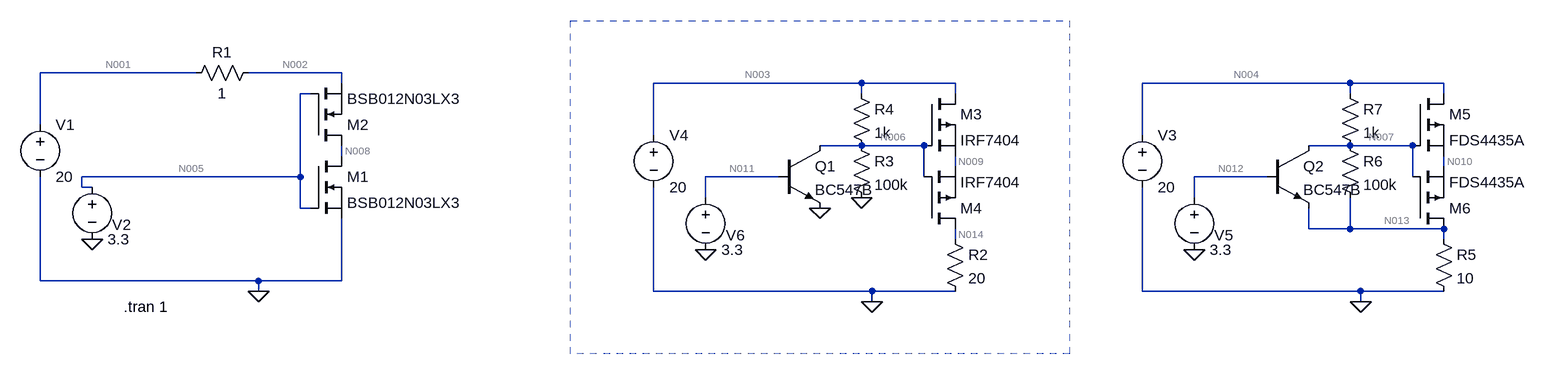
[diagram p0: schematic battery_switch.asc]
battery_switch.asc, the LTspice schematic file:
Version 4
SHEET 1 2052 680
WIRE 0 48 -240 48
WIRE 224 48 80 48
WIRE 224 64 224 48
WIRE 1024 64 704 64
WIRE 1168 64 1024 64
WIRE 1776 64 1456 64
WIRE 1920 64 1776 64
WIRE 176 80 160 80
WIRE 1024 80 1024 64
WIRE 1168 80 1168 64
WIRE 1776 80 1776 64
WIRE 1920 80 1920 64
WIRE -240 128 -240 48
WIRE 704 144 704 64
WIRE 1456 144 1456 64
WIRE 1024 160 960 160
WIRE 1120 160 1024 160
WIRE 1776 160 1712 160
WIRE 1872 160 1776 160
WIRE 224 176 224 160
WIRE 1168 192 1168 176
WIRE 1920 192 1920 176
WIRE 160 208 160 80
WIRE 160 208 -176 208
WIRE 896 208 784 208
WIRE 1120 208 1120 160
WIRE 1648 208 1536 208
WIRE 1872 208 1872 160
WIRE -176 224 -176 208
WIRE -160 224 -176 224
WIRE 784 240 784 208
WIRE 1536 240 1536 208
WIRE 160 256 160 208
WIRE 176 256 160 256
WIRE 1712 288 1712 256
WIRE 1776 288 1776 240
WIRE 1776 288 1712 288
WIRE 1920 288 1776 288
WIRE 1168 304 1168 288
WIRE 1920 304 1920 288
WIRE -240 368 -240 208
WIRE 96 368 -240 368
WIRE 224 368 224 272
WIRE 224 368 96 368
WIRE 96 384 96 368
WIRE 704 384 704 224
WIRE 1040 384 704 384
WIRE 1168 384 1040 384
WIRE 1456 384 1456 224
WIRE 1792 384 1456 384
WIRE 1920 384 1792 384
WIRE 1040 400 1040 384
WIRE 1792 400 1792 384
FLAG 96 384 0
FLAG -160 304 0
FLAG 1040 400 0
FLAG 784 320 0
FLAG 1024 240 0
FLAG 960 256 0
FLAG 1792 400 0
FLAG 1536 320 0
SYMBOL voltage -240 112 R0
WINDOW 123 0 0 Left 0
WINDOW 39 0 0 Left 0
SYMATTR InstName V1
SYMATTR Value 20
SYMBOL nmos 176 176 R0
SYMATTR InstName M1
SYMATTR Value BSB012N03LX3
SYMBOL nmos 176 160 M180
SYMATTR InstName M2
SYMATTR Value BSB012N03LX3
SYMBOL voltage -160 208 R0
WINDOW 0 31 74 Left 2
WINDOW 123 0 0 Left 0
WINDOW 39 0 0 Left 0
SYMATTR InstName V2
SYMATTR Value 3.3
SYMBOL res -16 64 R270
WINDOW 0 32 56 VTop 2
WINDOW 3 0 56 VBottom 2
SYMATTR InstName R1
SYMATTR Value 1
SYMBOL voltage 704 128 R0
WINDOW 123 0 0 Left 0
WINDOW 39 0 0 Left 0
SYMATTR InstName V4
SYMATTR Value 20
SYMBOL voltage 784 224 R0
WINDOW 0 31 74 Left 2
WINDOW 123 0 0 Left 0
WINDOW 39 0 0 Left 0
SYMATTR InstName V6
SYMATTR Value 3.3
SYMBOL res 1152 288 R0
SYMATTR InstName R2
SYMATTR Value 20
SYMBOL pmos 1120 80 R0
SYMATTR InstName M3
SYMATTR Value IRF7404
SYMBOL pmos 1120 288 M180
SYMATTR InstName M4
SYMATTR Value IRF7404
SYMBOL npn 896 160 R0
SYMATTR InstName Q1
SYMATTR Value BC547B
SYMBOL res 1008 144 R0
SYMATTR InstName R3
SYMATTR Value 100k
SYMBOL res 1008 64 R0
SYMATTR InstName R4
SYMATTR Value 1k
SYMBOL voltage 1456 128 R0
WINDOW 123 0 0 Left 0
WINDOW 39 0 0 Left 0
SYMATTR InstName V3
SYMATTR Value 20
SYMBOL voltage 1536 224 R0
WINDOW 0 31 74 Left 2
WINDOW 123 0 0 Left 0
WINDOW 39 0 0 Left 0
SYMATTR InstName V5
SYMATTR Value 3.3
SYMBOL res 1904 288 R0
SYMATTR InstName R5
SYMATTR Value 10
SYMBOL pmos 1872 80 R0
SYMATTR InstName M5
SYMATTR Value FDS4435A
SYMBOL pmos 1872 288 M180
SYMATTR InstName M6
SYMATTR Value FDS4435A
SYMBOL npn 1648 160 R0
SYMATTR InstName Q2
SYMATTR Value BC547B
SYMBOL res 1760 144 R0
SYMATTR InstName R6
SYMATTR Value 100k
SYMBOL res 1760 64 R0
SYMATTR InstName R7
SYMATTR Value 1k
TEXT -112 408 Left 2 !.tran 1
RECTANGLE Normal 1344 480 576 -32 2

The netlist it stands for:
* battery_switch.asc
V1 N001 0 20
M1 N008 N005 0 0 BSB012N03LX3
M2 N008 N005 N002 N002 BSB012N03LX3
V2 N005 0 3.3
R1 N001 N002 1
V4 N003 0 20
V6 N011 0 3.3
R2 N014 0 20
M3 N003 N006 N009 N009 IRF7404
M4 N014 N006 N009 N009 IRF7404
Q1 N006 N011 0 0 BC547B
R3 N006 0 100k
R4 N003 N006 1k
V3 N004 0 20
V5 N012 0 3.3
R5 N013 0 10
M5 N004 N007 N010 N010 FDS4435A
M6 N013 N007 N010 N010 FDS4435A
Q2 N007 N012 N013 0 BC547B
R6 N007 N013 100k
R7 N004 N007 1k
.model NPN NPN
.model PNP PNP
.lib standard.bjt
.model NMOS NMOS
.model PMOS PMOS
.lib standard.mos
.tran 1
.backanno
.end

* Results of the author's LTspice run, read from the files saved beside the schematic
* Operating Point, zero values left out:
*   V(n001) = 20 V
*   V(n008) = 51.76 mV
*   V(n005) = 3.3 V
*   V(n002) = 108.5 mV
*   V(n003) = 20 V
*   V(n011) = 3.3 V
*   V(n014) = 19.94 V
*   V(n006) = 821.7 mV
*   V(n009) = 19.97 V
*   V(n004) = 20 V
*   V(n012) = 3.3 V
*   V(n013) = 2.669 V
*   V(n007) = 18.91 V
*   V(n010) = 19.95 V
*   Ic(Q1) = 19.17 mA
*   Ib(Q1) = 1.617 A
*   Ie(Q1) = -1.636 A
*   Ic(Q2) = 931.7 µA
*   Ib(Q2) = 2.63 µA
*   Ie(Q2) = -934.3 µA
*   Id(M1) = 19.89 A
*   Is(M1) = -19.89 A
*   Id(M2) = -19.89 A
*   Is(M2) = 19.89 A
*   Id(M3) = 997 mA
*   Is(M3) = -997 mA
*   Id(M4) = -997 mA
*   Is(M4) = 997 mA
*   Id(M5) = 265.8 mA
*   Is(M5) = -265.8 mA
*   Id(M6) = -265.8 mA
*   Is(M6) = 265.8 mA
*   I(R1) = 19.89 A
*   I(R2) = 997 mA
*   I(R3) = 8.217 µA
*   I(R4) = 19.18 mA
*   I(R5) = 266.9 mA
*   I(R6) = 162.4 µA
*   I(R7) = 1.094 mA
*   I(V1) = -19.89 A
*   I(V4) = -1.016 A
*   I(V6) = -1.617 A
*   I(V3) = -266.9 mA
*   I(V5) = -2.63 µA